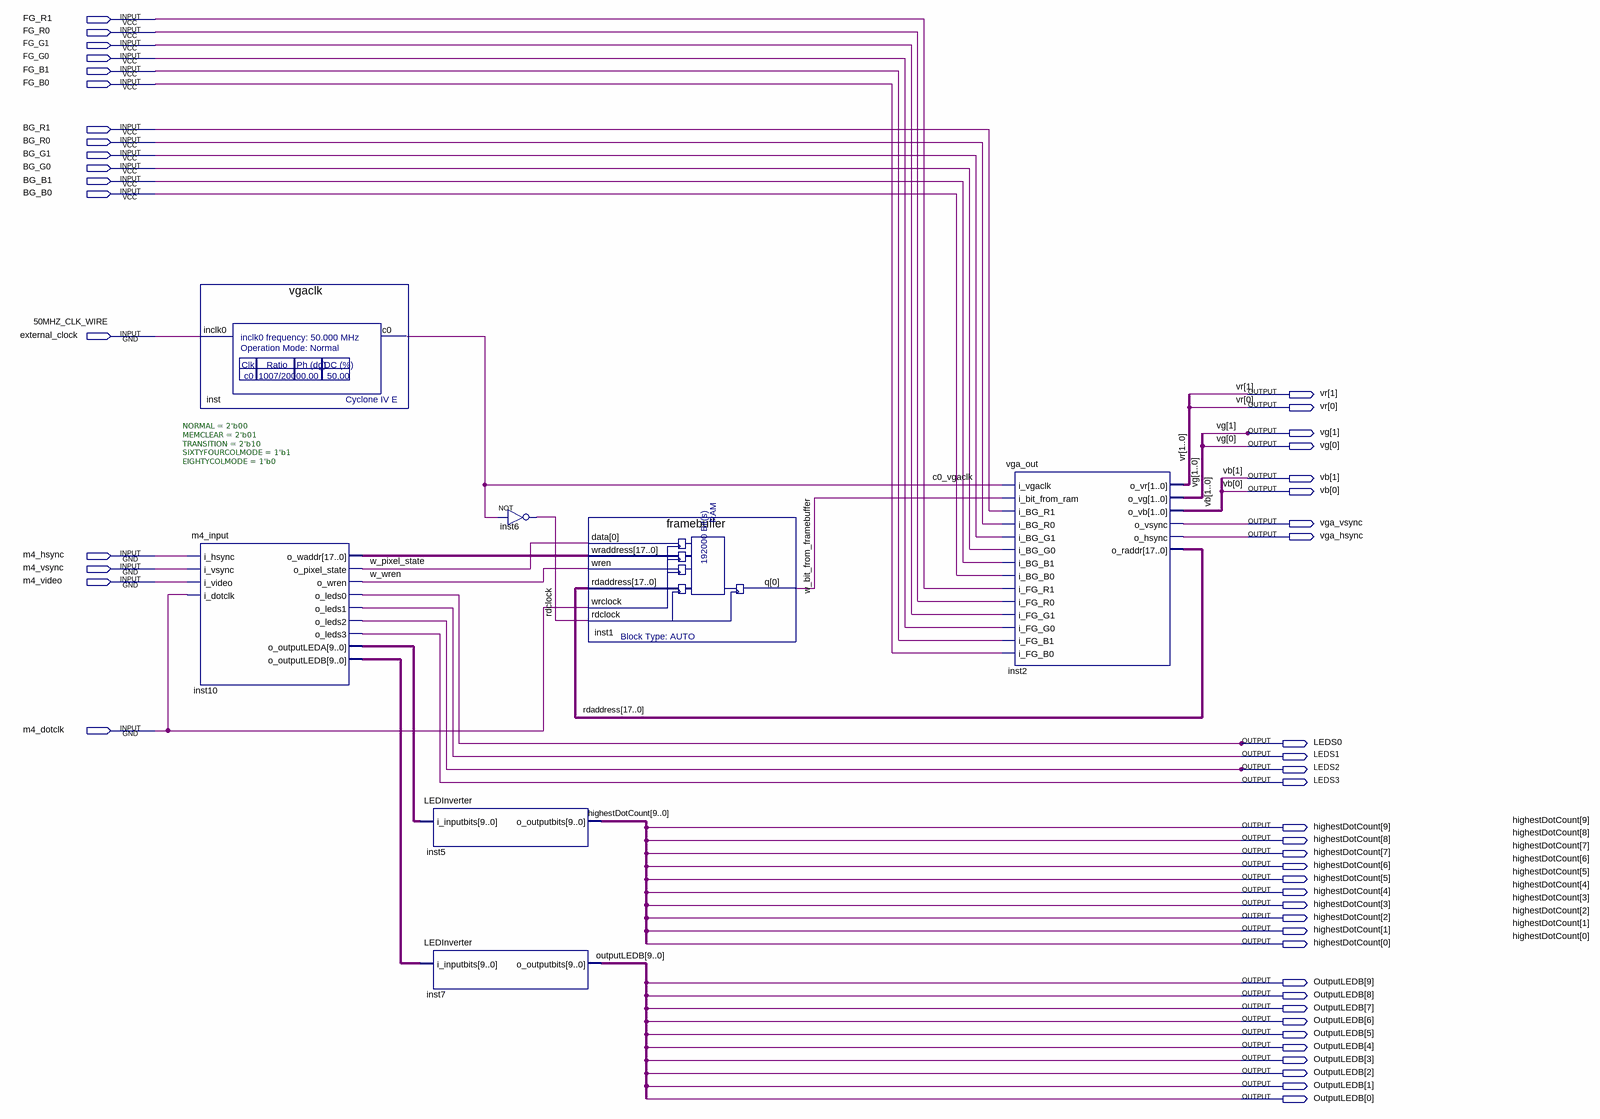
[diagram p0: schematic sheet]
// Quartus schematic M4ToVGA_top.bdf as structural Verilog: 7 symbols, 49 pins
module M4ToVGA_top (
  input  FG_R1,
  input  FG_R0,
  input  FG_G1,
  input  FG_G0,
  input  FG_B1,
  input  FG_B0,
  input  BG_R1,
  input  BG_R0,
  input  BG_G1,
  input  BG_G0,
  input  BG_B1,
  input  BG_B0,
  input  external_clock,
  input  m4_hsync,
  input  m4_vsync,
  input  m4_video,
  input  m4_dotclk,
  output [1:0] vr,
  output [1:0] vg,
  output [1:0] vb,
  output vga_vsync,
  output vga_hsync,
  output LEDS0,
  output LEDS1,
  output LEDS2,
  output LEDS3,
  output [9:0] highestDotCount,
  output [9:0] OutputLEDB
);

  wire c0_vgaclk, rdclock, w_bit_from_framebuffer, w_pixel_state, w_wren;
  wire [9:0] inst10_o_outputleda, inst10_o_outputledb;
  wire [17:0] inst10_o_waddr, rdaddress;

  vgaclk inst (.inclk0(external_clock), .c0(c0_vgaclk));
  m4_input #(.NORMAL(2'b00), .MEMCLEAR(2'b01), .TRANSITION(2'b10), .SIXTYFOURCOLMODE(1'b1), .EIGHTYCOLMODE(1'b0)) inst10 (
    .i_hsync(m4_hsync), .i_vsync(m4_vsync), .i_video(m4_video), .i_dotclk(m4_dotclk),
    .o_waddr(inst10_o_waddr), .o_pixel_state(w_pixel_state), .o_wren(w_wren), .o_leds0(LEDS0),
    .o_leds1(LEDS1), .o_leds2(LEDS2), .o_leds3(LEDS3), .o_outputLEDA(inst10_o_outputleda),
    .o_outputLEDB(inst10_o_outputledb));
  LEDInverter inst5 (.i_inputbits(inst10_o_outputleda), .o_outputbits(highestDotCount));
  LEDInverter inst7 (.i_inputbits(inst10_o_outputledb), .o_outputbits(OutputLEDB));
  not inst6 (rdclock, c0_vgaclk);
  framebuffer inst1 (
    .data(w_pixel_state), .wraddress(inst10_o_waddr), .wren(w_wren), .rdaddress(rdaddress),
    .wrclock(m4_dotclk), .rdclock(rdclock), .q(w_bit_from_framebuffer));
  vga_out inst2 (
    .i_vgaclk(c0_vgaclk), .i_bit_from_ram(w_bit_from_framebuffer), .i_BG_R1(BG_R1), .i_BG_R0(BG_R0),
    .i_BG_G1(BG_G1), .i_BG_G0(BG_G0), .i_BG_B1(BG_B1), .i_BG_B0(BG_B0), .i_FG_R1(FG_R1), .i_FG_R0(FG_R0),
    .i_FG_G1(FG_G1), .i_FG_G0(FG_G0), .i_FG_B1(FG_B1), .i_FG_B0(FG_B0), .o_vr(vr), .o_vg(vg), .o_vb(vb),
    .o_vsync(vga_vsync), .o_hsync(vga_hsync), .o_raddr(rdaddress));

  // Other names for the same wires on the sheet: 50MHZ_CLK_WIRE = external_clock
endmodule
